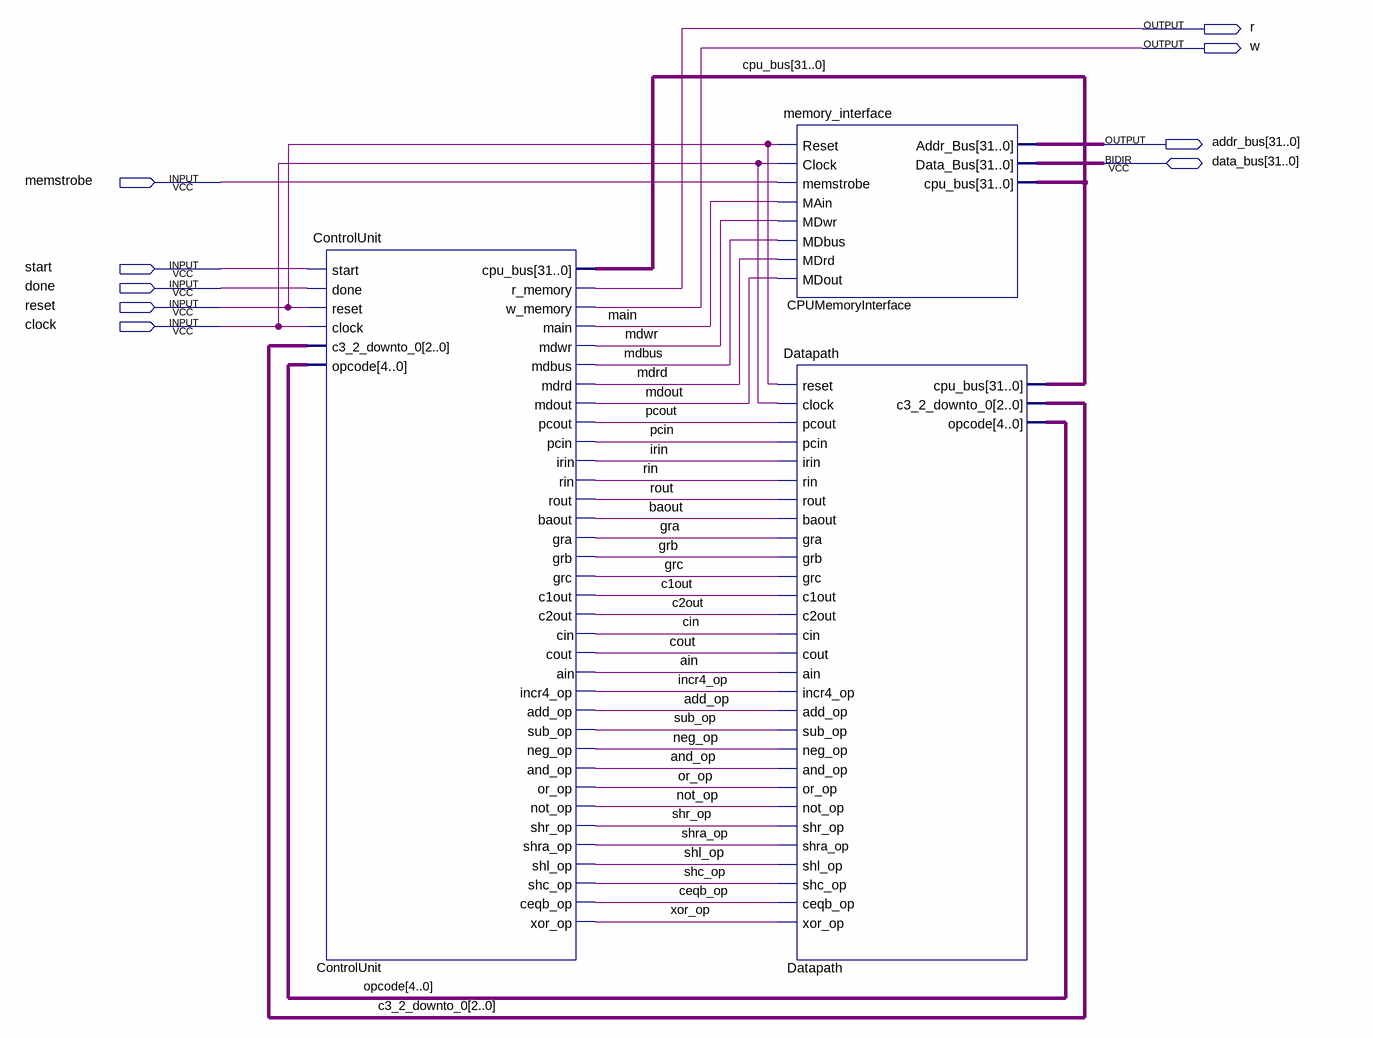
[diagram p0: schematic sheet]
// Quartus schematic CPU.bdf as structural Verilog: 3 symbols, 9 pins
module CPU (
  input  memstrobe,
  input  start,
  input  done,
  input  reset,
  input  clock,
  inout  [31:0] data_bus,
  output r,
  output w,
  output [31:0] addr_bus
);

  wire add_op, ain, and_op, baout, c1out, c2out, ceqb_op, cin, cout, gra, grb, grc, incr4_op, irin, main,
       mdbus, mdout, mdrd, mdwr, neg_op, not_op, or_op, pcin, pcout, rin, rout, shc_op, shl_op, shr_op,
       shra_op, sub_op, xor_op;
  wire [2:0] c3_2_downto_0;
  wire [4:0] opcode;
  wire [31:0] cpu_bus;

  ControlUnit ControlUnit (
    .start(start), .done(done), .reset(reset), .clock(clock), .c3_2_downto_0(c3_2_downto_0), .opcode(opcode),
    .r_memory(r), .w_memory(w), .main(main), .mdwr(mdwr), .mdbus(mdbus), .mdrd(mdrd), .mdout(mdout),
    .pcout(pcout), .pcin(pcin), .irin(irin), .rin(rin), .rout(rout), .baout(baout), .gra(gra), .grb(grb),
    .grc(grc), .c1out(c1out), .c2out(c2out), .cin(cin), .cout(cout), .ain(ain), .incr4_op(incr4_op),
    .add_op(add_op), .sub_op(sub_op), .neg_op(neg_op), .and_op(and_op), .or_op(or_op), .not_op(not_op),
    .shr_op(shr_op), .shra_op(shra_op), .shl_op(shl_op), .shc_op(shc_op), .ceqb_op(ceqb_op), .xor_op(xor_op),
    .cpu_bus(cpu_bus));
  memory_interface CPUMemoryInterface (
    .Reset(reset), .Clock(clock), .memstrobe(memstrobe), .MAin(main), .MDwr(mdwr), .MDbus(mdbus),
    .MDrd(mdrd), .MDout(mdout), .Addr_Bus(addr_bus), .Data_Bus(data_bus), .cpu_bus(cpu_bus));
  Datapath Datapath (
    .reset(reset), .clock(clock), .pcout(pcout), .pcin(pcin), .irin(irin), .rin(rin), .rout(rout),
    .baout(baout), .gra(gra), .grb(grb), .grc(grc), .c1out(c1out), .c2out(c2out), .cin(cin), .cout(cout),
    .ain(ain), .incr4_op(incr4_op), .add_op(add_op), .sub_op(sub_op), .neg_op(neg_op), .and_op(and_op),
    .or_op(or_op), .not_op(not_op), .shr_op(shr_op), .shra_op(shra_op), .shl_op(shl_op), .shc_op(shc_op),
    .ceqb_op(ceqb_op), .xor_op(xor_op), .c3_2_downto_0(c3_2_downto_0), .opcode(opcode), .cpu_bus(cpu_bus));
endmodule
